# Altium schematic sheet node.SchDoc: Node
size A4; Organization: GPA Robotics; DocumentNumber: 2; Revision: REV 0; SheetNumber: 2; SheetTotal: 4
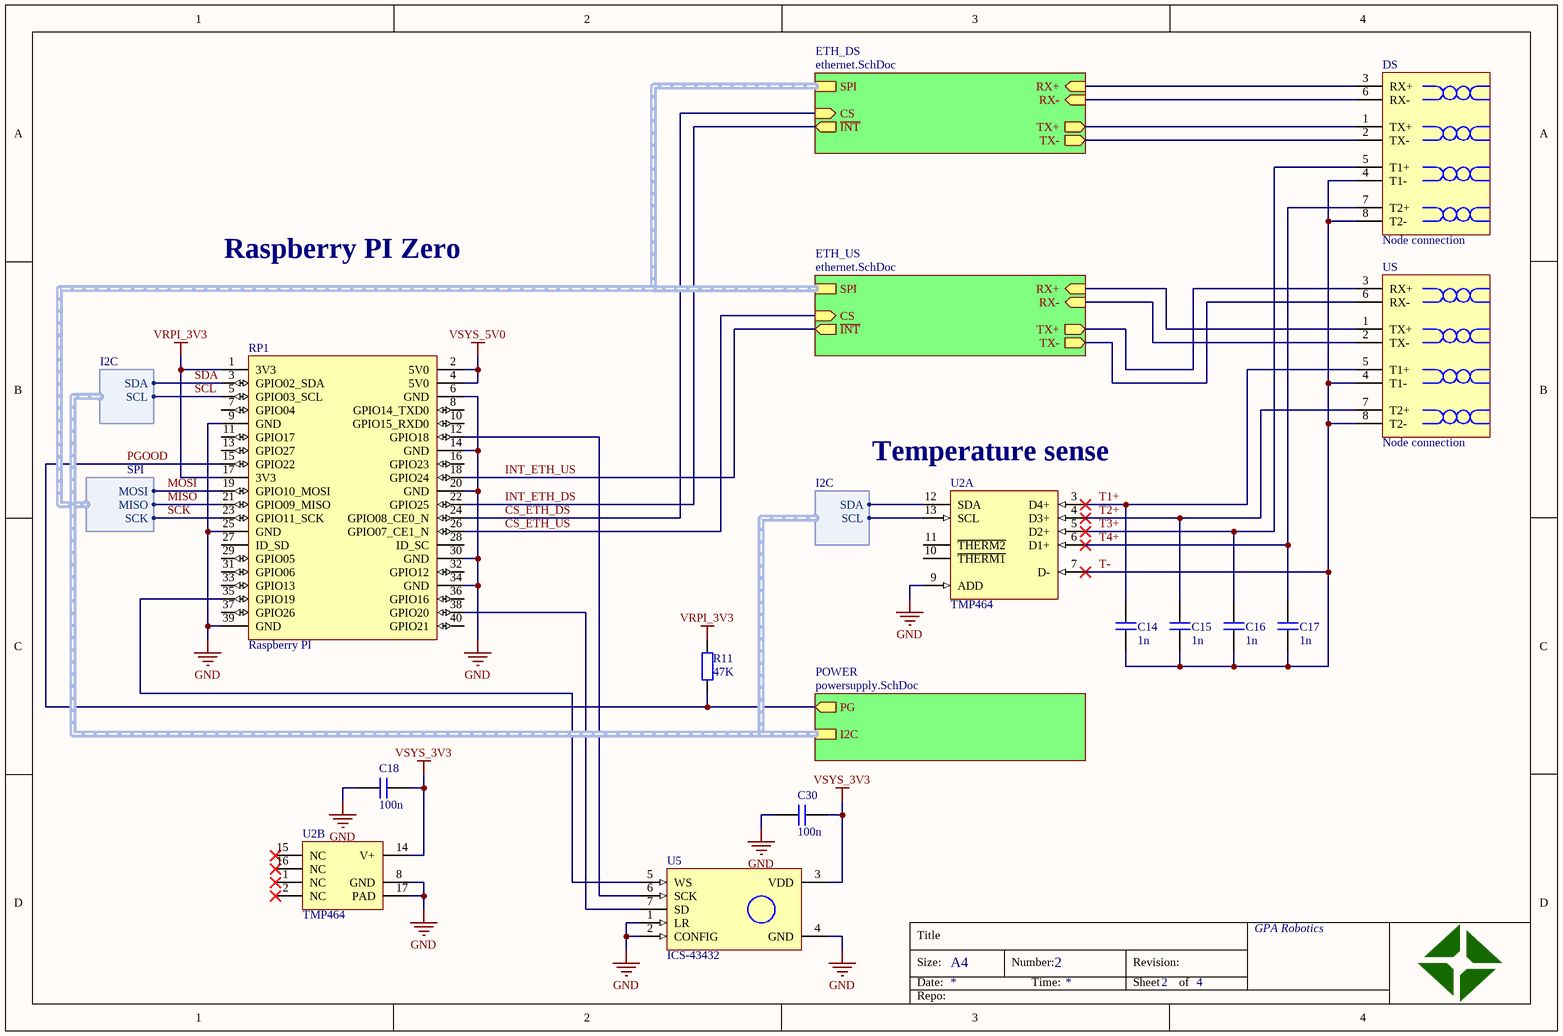
[diagram p0: node.SchDoc]

## Parts
C14  value 1n  [CAPC1005X06N]  (hidden comment: cap)
C15  value 1n  [CAPC1005X06N]  (hidden comment: cap)
C16  value 1n  [CAPC1005X06N]  (hidden comment: cap)
C17  value 1n  [CAPC1005X06N]  (hidden comment: cap)
C18  value 100n  [CAPC1005X06N]  (hidden comment: cap)
C30  value 100n  [CAPC1005X06N]  (hidden comment: cap)
DS  Node connection  [node_connection]  (no BOM)
R11  value 47K  [RESC1005X04N]  (hidden comment: res)
RP1  Raspberry PI  [raspi_male_con]
U2  TMP464  [QFN50P300X300X100_HS-17N_TMP464]  (parts A,B of 2)
U5  ICS-43432  [PSON65P300X110-6N]
US  Node connection  [node_connection]  (no BOM)

## Sub-sheets
ETH_DS = ethernet.SchDoc: RX+ (in), TX+ (out), RX- (in), TX- (out), SPI (harness SPI), CS (in), ~{INT} (out)
ETH_US = ethernet.SchDoc: RX+ (in), TX+ (out), RX- (in), TX- (out), SPI (harness SPI), CS (in), ~{INT} (out)
POWER = powersupply.SchDoc: PG (out), I2C (harness I2C)

## Harnesses
SPI: MOSI, MISO, SCK
I2C: SDA, SCL

## Nets
GND: C18.1 C30.1 RP1.6(GND) RP1.9(GND) RP1.14(GND) RP1.20(GND) RP1.25(GND) RP1.30(GND) RP1.34(GND) RP1.39(GND) U2.8(GND) U2.9(ADD) U2.17(PAD) U5.1(LR) U5.2(CONFIG) U5.4(GND)
VRPI_3V3: R11.2 RP1.1(3V3) RP1.17(3V3)
VSYS_3V3: C18.2 C30.2 U2.14(V+) U5.3(VDD)
VSYS_5V0: RP1.2(5V0) RP1.4(5V0)
CS_ETH_DS: RP1.24(GPIO08_CE0_N) ; sheet ETH_DS/CS
CS_ETH_US: RP1.26(GPIO07_CE1_N) ; sheet ETH_US/CS
INT_ETH_DS: RP1.22(GPIO25) ; sheet ETH_DS/~{INT}
INT_ETH_US: RP1.18(GPIO24) ; sheet ETH_US/~{INT}
MISO: RP1.21(GPIO09_MISO) ; sheet ETH_US/SPI.MISO
MOSI: RP1.19(GPIO10_MOSI) ; sheet ETH_US/SPI.MOSI
PGOOD: R11.1 RP1.15(GPIO22) ; sheet POWER/PG
SCK: RP1.23(GPIO11_SCK) ; sheet ETH_US/SPI.SCK
SCL: RP1.5(GPIO03_SCL) U2.13(SCL) ; sheet POWER/I2C.SCL
SDA: RP1.3(GPIO02_SDA) U2.12(SDA) ; sheet POWER/I2C.SDA
T1+: C14.2 U2.3(D4+) US.5(T1+)
T2+: C15.2 U2.4(D3+) US.7(T2+)
T3+: C16.2 DS.5(T1+) U2.5(D2+)
T4+: C17.2 DS.7(T2+) U2.6(D1+)
T-: C14.1 C15.1 C16.1 C17.1 DS.4(T1-) DS.8(T2-) U2.7(D-) US.4(T1-) US.8(T2-)
NetDS_1: DS.1(TX+) ; sheet ETH_DS/TX+
NetDS_2: DS.2(TX-) ; sheet ETH_DS/TX-
NetDS_3: DS.3(RX+) ; sheet ETH_DS/RX+
NetDS_6: DS.6(RX-) ; sheet ETH_DS/RX-
NetRP1_12: RP1.12(GPIO18) U5.6(SCK)
NetRP1_35: RP1.35(GPIO19) U5.5(WS)
NetRP1_38: RP1.38(GPIO20) U5.7(SD)
NetUS_1: US.1(TX+) ; sheet ETH_US/RX+
NetUS_2: US.2(TX-) ; sheet ETH_US/RX-
NetUS_3: US.3(RX+) ; sheet ETH_US/TX+
NetUS_6: US.6(RX-) ; sheet ETH_US/TX-

Not connected (* = marked no-connect by the designer): RP1 7(GPIO04) 8(GPIO14_TXD0) 10(GPIO15_RXD0) 11(GPIO17) 13(GPIO27) 16(GPIO23) 27(ID_SD) 28(ID_SC) 29(GPIO05) 31(GPIO06) 32(GPIO12) 33(GPIO13) 36(GPIO16) 37(GPIO26) 40(GPIO21); U2 1(NC)* 2(NC)* 10(~{THERM1}) 11(~{THERM2}) 15(NC)* 16(NC)*

## Buses and harness runs
harness sheet ETH_DS/SPI = sheet ETH_US/SPI

## Notes on the sheet
- Raspberry PI Zero
- (near U2) Temperature sense
- Title
- Size:
- Date:
- A4
- Number:
- Time:
- Revision:
- Sheet
- of
- Repo:

## Library data of the parts
C14-C18 C30 = cap: Capacitor; voltage: *; type: *; #digikey: *; #mouser: *
DS US = node_connection
R11 = res: Resistor; power: *; voltage: *; #digikey: *; #mouser: *
RP1 = raspberry_2x20_con: Raspberry PI 2x20 connector
U2 = tmp464rgt: High-Accuracy 5-Channel (4-Remote and 1-Local) Temperature Sensor; ComponentLink1Description: Datasheet; ComponentLink1URL: https://www.ti.com/lit/ds/symlink/tmp464.pdf; Supplier 1: Digi-Key; Supplier Part Number 1: 296-46946-1-ND; Supplier 2: Digi-Key; Supplier Part Number 2: 296-50713-1-ND